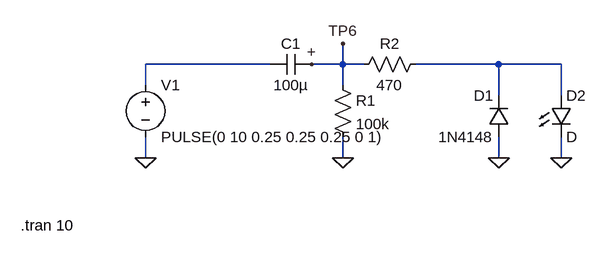
[diagram p0: schematic Led_Rojo.asc]
Led_Rojo.asc, the LTspice schematic file:
Version 4
SHEET 1 1284 680
WIRE -80 144 -272 144
WIRE 32 144 32 112
WIRE 32 144 -16 144
WIRE 64 144 32 144
WIRE 272 144 144 144
WIRE 368 144 272 144
WIRE -272 176 -272 144
WIRE 32 176 32 144
WIRE 272 192 272 144
WIRE 368 192 368 144
WIRE -272 288 -272 256
WIRE 32 288 32 256
WIRE 272 288 272 256
WIRE 368 288 368 256
FLAG -16 144 +
FLAG 32 112 TP6
FLAG 32 288 0
FLAG 272 288 0
FLAG 368 288 0
FLAG -272 288 0
SYMBOL cap -16 128 R90
WINDOW 0 0 32 VBottom 2
WINDOW 3 32 32 VTop 2
SYMATTR InstName C1
SYMATTR Value 100µ
SYMBOL res 16 160 R0
SYMATTR InstName R1
SYMATTR Value 100k
SYMBOL res 160 128 R90
WINDOW 0 0 56 VBottom 2
WINDOW 3 32 56 VTop 2
SYMATTR InstName R2
SYMATTR Value 470
SYMBOL diode 288 256 R180
WINDOW 0 24 64 Left 2
WINDOW 3 24 0 Left 2
SYMATTR InstName D1
SYMATTR Value 1N4148
SYMBOL voltage -272 160 R0
WINDOW 123 0 0 Left 0
WINDOW 39 0 0 Left 0
SYMATTR InstName V1
SYMATTR Value PULSE(0 10 0.25 0.25 0.25 0 1)
SYMBOL LED 352 192 R0
SYMATTR InstName D2
TEXT -464 392 Left 2 !.tran 10

The netlist it stands for:
* Led_Rojo.asc
C1 TP6 N001 100µ
R1 TP6 0 100k
R2 N002 TP6 470
D1 0 N002 1N4148
V1 N001 0 PULSE(0 10 0.25 0.25 0.25 0 1)
D2 N002 0 D
.model D D
.lib standard.dio
.tran 10
.backanno
.end